# EAGLE design followLineSensor (EAGLE 7.7.0)
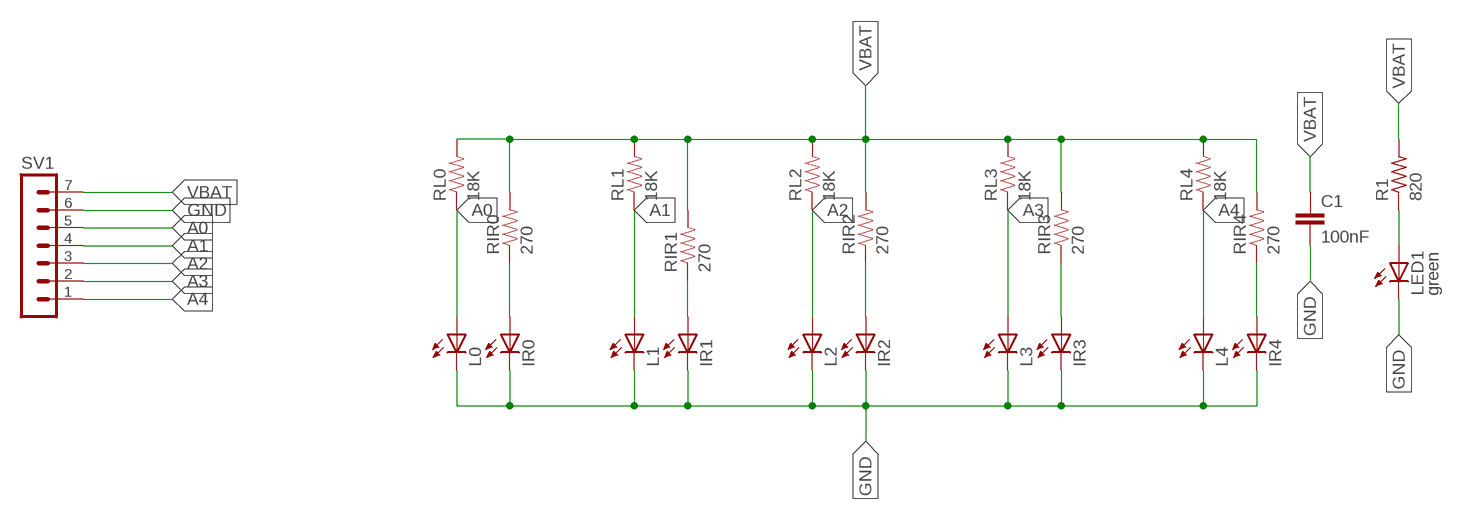
[diagram p0: schematic, sheet 1]

## Parts
C1  100nF  C-EUC0805  [C0805]
IR0  LED5MM  [LED5MM]
IR1  LED5MM  [LED5MM]
IR2  LED5MM  [LED5MM]
IR3  LED5MM  [LED5MM]
IR4  LED5MM  [LED5MM]
L0  LED5MM  [LED5MM]
L1  LED5MM  [LED5MM]
L2  LED5MM  [LED5MM]
L3  LED5MM  [LED5MM]
L4  LED5MM  [LED5MM]
LED1  green  LEDSML0805  [SML0805]
R1  820  R-US_R0805  [R0805]
RIR0  270  RESISTOR1206  [1206]
RIR1  270  RESISTOR1206  [1206]
RIR2  270  RESISTOR1206  [1206]
RIR3  270  RESISTOR1206  [1206]
RIR4  270  RESISTOR1206  [1206]
RL0  18K  RESISTOR1206  [1206]
RL1  18K  RESISTOR1206  [1206]
RL2  18K  RESISTOR1206  [1206]
RL3  18K  RESISTOR1206  [1206]
RL4  18K  RESISTOR1206  [1206]
SV1  MA07-1  [MA07-1]

## Nets
A0: L0.A RL0.1 SV1.5
A1: L1.A RL1.1 SV1.4
A2: L2.A RL2.1 SV1.3
A3: L3.A RL3.1 SV1.2
A4: L4.A RL4.1 SV1.1
GND: C1.2 IR0.K(C) IR1.K(C) IR2.K(C) IR3.K(C) IR4.K(C) L0.K(C) L1.K(C) L2.K(C) L3.K(C) L4.K(C) LED1.C SV1.6
N$2: LED1.A R1.1
N$17: IR4.A RIR4.1
N$18: IR3.A RIR3.1
N$19: IR2.A RIR2.1
N$20: IR1.A RIR1.1
N$21: IR0.A RIR0.1
VBAT: C1.1 R1.2 RIR0.2 RIR1.2 RIR2.2 RIR3.2 RIR4.2 RL0.2 RL1.2 RL2.2 RL3.2 RL4.2 SV1.7

## Library data of the parts
C1 = rcl:C-EU: CAPACITOR, European symbol
IR0 IR1-IR4 L0 L1-L4 LED1 = led:LED: LED OSRAM: - CHIPLED LG R971, LG N971, LY N971, LG Q971, LY Q971, LO R971, LY R971 LH N974, LH R974 LS Q976, LO Q976, LY Q976 LO Q996 - Hyper CHIPLED LW Q18S LB Q993, LB Q99A, LB R99A - SideLED LS A670, LO A670, LY A670, LG A670, LP A670 LB A673, LV A673, LT A673, LW A673 LH A674 LY A675 LS A676, LA A676, LO A676, LY A676, LW A676 LS A679, LY A679, LG A679 - Hyper Micro SIDELED® LS Y876, LA Y876, LO Y876, LY Y876 LT Y87S - SmartLED LW L88C, LW L88S LB L89C, LB L89S, LG L890 LS L89K, LO L89K, LY L89K LS L896, LA L896, LO L896, LY L896 - TOPLED LS T670, LO T670, LY T670, LG T670, LP T670 LSG T670, LSP T670, LSY T670, LOP T670, LYG T670 LG T671, LOG T671, LSG T671 LB T673, LV T673, LT T673, LW T673 LH T674 LS T676, LA T676, LO T676, LY T676, LB T676, LH T676, LSB T676, LW T676 LB T67C, LV T67C, LT T67C, LS T67K, LO T67K, LY T67K, LW E67C LS E67B, LA E67B, LO E67B, LY E67B, LB E67C, LV E67C, LT E67C LW T67C LS T679, LY T679, LG T679 LS T770, LO T770, LY T770, LG T770, LP T770 LB T773, LV T773, LT T773, LW T773 LH T774 LS E675, LA E675, LY E675, LS T675 LS T776, LA T776, LO T776, LY T776, LB T776 LHGB T686 LT T68C, LB T68C - Hyper Mini TOPLED® LB M676 - Mini TOPLED Santana® LG M470 LS M47K, LO M47K, LY M47K Source: http://www.osram.convergy.de LUXEON: - LUMILED® LXK2-PW12-R00, LXK2-PW12-S00, LXK2-PW14-U00, LXK2-PW14-V00 LXK2-PM12-R00, LXK2-PM12-S00, LXK2-PM14-U00 LXK2-PE12-Q00, LXK2-PE12-R00, LXK2-PE12-S00, LXK2-PE14-T00, LXK2-PE14-U00 LXK2-PB12-K00, LXK2-PB12-L00, LXK2-PB12-M00, LXK2-PB14-N00, LXK2-PB14-P00, LXK2-PB14-Q00 LXK2-PR12-L00, LXK2-PR12-M00, LXK2-PR14-Q00, LXK2-PR14-R00 LXK2-PD12-Q00, LXK2-PD12-R00, LXK2-PD12-S00 LXK2-PH12-R00, LXK2-PH12-S00 LXK2-PL12-P00, LXK2-PL12-Q00, LXK2-PL12-R00 Source: www.luxeon.com KINGBRIGHT: KA-3528ASYC Source: www.kingbright.com
R1 = rcl:R-US_: RESISTOR, American symbol
RIR0 RIR1-RIR4 RL0 RL1-RL4 = SparkFun-Passives:RESISTOR: Resistor Basic schematic elements and footprints for 0603, 1206, and PTH resistors.
SV1 = con-lstb:MA07-1: PIN HEADER; OC_FARNELL: unknown; OC_NEWARK: unknown

## Board
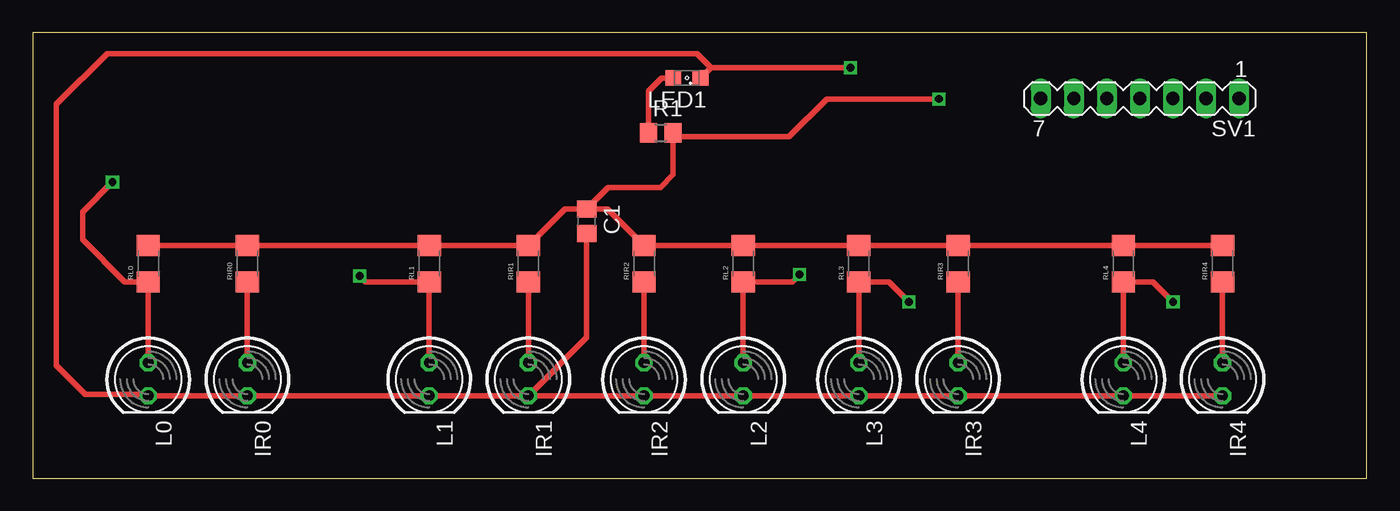
[diagram p1: board, top side]
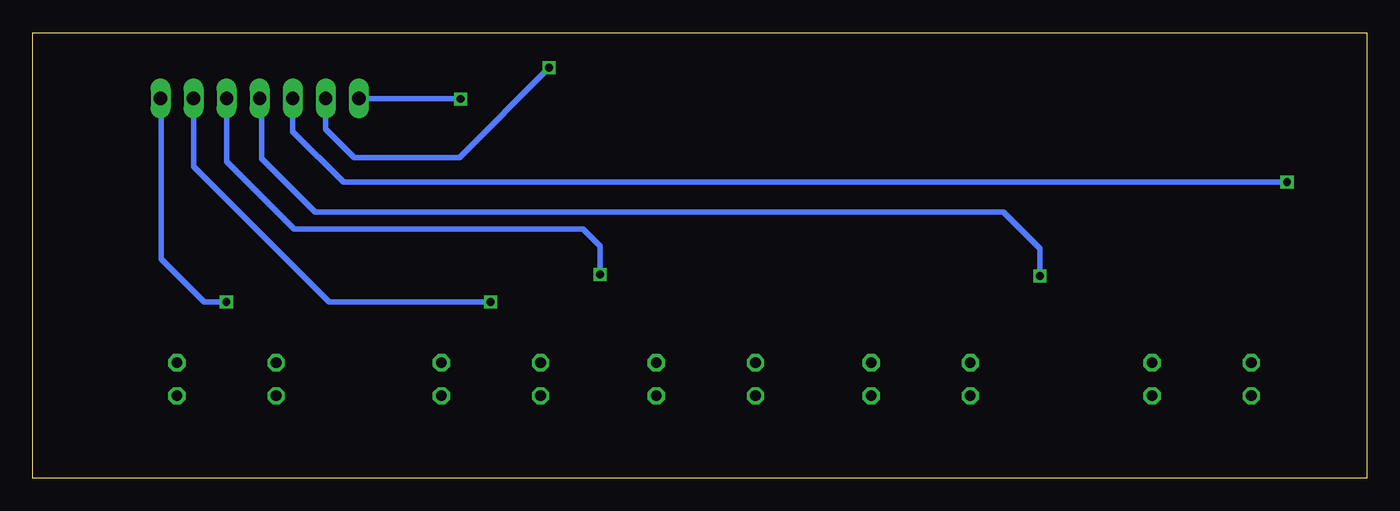
[diagram p2: board, bottom side, seen from below]

Size 102.54 x 34.28 mm. Coordinates in mm from the lower left corner, seen from the top.
Outline: 0,0 102.54,0 102.54,34.28 0,34.28 0,0
Copper layers (1*16): Top 0.035mm / dielectric 1.5mm / Bottom 0.035mm
Design rules "default *": minimum track width 0.4mm, minimum drill 24mil, track to track 8mil, track to pad 8mil, pad to pad 8mil, via to via 8mil, smd to smd 8mil, copper to edge 40mil, drill to drill 8mil, minimum pad ring 10mil, minimum via ring 8mil, stop-mask expansion 4mil, vias tented up to drill 0mil, thermal gap 10mil

### Footprints (pad centres in the part's own frame; a part is rotated, then mirrored left to right if it is on the bottom)
C0805 = smd 1.3 x 1.5: 1 -0.95,0; 2 0.95,0
LED5MM = drill 0.813 octagon: A -1.27,0; K 1.27,0
SML0805 = smd 1.2 x 1.2: A 1.05,0; C -1.05,0
R0805 = smd 1.3 x 1.5: 1 -0.95,0; 2 0.95,0
1206 = smd 1.6 x 1.8: 1 -1.4,0; 2 1.4,0
MA07-1 = drill 1.016 long: 1 -7.62,0; 2 -5.08,0; 3 -2.54,0; 4 0,0; 5 2.54,0; 6 5.08,0; 7 7.62,0

### Placement (x,y rotation side)
C1  42.58,19.77 270 top
IR0  16.51,7.62 270 top
IR1  38.1,7.62 270 top
IR2  46.99,7.62 270 top
IR3  71.12,7.62 270 top
IR4  91.44,7.62 270 top
L0  8.89,7.62 270 top
L1  30.48,7.62 270 top
L2  54.61,7.62 270 top
L3  63.5,7.62 270 top
L4  83.82,7.62 270 top
LED1  50.28,30.78 180 top
R1  48.28,26.57 0 top
RIR0  16.51,16.51 90 top
RIR1  38.1,16.51 90 top
RIR2  46.99,16.51 90 top
RIR3  71.12,16.51 90 top
RIR4  91.44,16.51 90 top
RL0  8.89,16.51 90 top
RL1  30.48,16.51 90 top
RL2  54.61,16.51 90 top
RL3  63.5,16.51 90 top
RL4  83.82,16.51 90 top
SV1  85.09,29.21 180 top

### Tracks (layer width: path | path; a pad name or v marks a point on that pad's centre or on a via)
A0  (via drill 0.6)
  Top 0.406: L0.A RL0.1 7.1,15.11 3.84,18.37 3.84,20.47 v6.14,22.77
  Bottom 0.406: v6.14,22.77 78.64,22.77 82.54,26.67 SV1.5
A1  (via drill 0.6)
  Top 0.406: L1.A RL1.1 25.6,15.11 v25.14,15.57
  Bottom 0.406: v25.14,15.57 25.14,17.67 27.94,20.47 80.84,20.47 84.94,24.57 84.94,29.06 SV1.4
A2  (via drill 0.6)
  Top 0.406: L2.A RL2.1 58.38,15.11 v58.94,15.67
  Bottom 0.406: v58.94,15.67 58.94,17.87 60.24,19.17 82.44,19.17 87.64,24.37 SV1.3
A3  (via drill 0.6)
  Top 0.406: L3.A RL3.1 65.8,15.11 v67.34,13.57
  Bottom 0.406: v67.34,13.57 79.74,13.57 90.14,23.97 90.14,29.18 SV1.2
A4  (via drill 0.6)
  Top 0.406: L4.A RL4.1 86.1,15.11 v87.64,13.57
  Bottom 0.406: v87.64,13.57 89.34,13.57 92.64,16.87 92.64,29.14 SV1.1
GND  (via drill 0.6)
  Top 0.406: IR1.K L1.K IR0.K L0.K 8.77,6.47 4.04,6.47 1.84,8.67 1.84,28.77 5.74,32.67 51.04,32.67 52.14,31.57 | IR1.K IR2.K L2.K L3.K IR3.K L4.K IR4.K | C1.2 42.58,10.83 IR1.K | v62.84,31.57 52.14,31.57 | 52.14,31.57 52.12,31.57 LED1.C 51.35,30.78 52.14,31.57
  Bottom 0.406: SV1.6 80.01,26.84 77.84,24.67 69.74,24.67 v62.84,31.57
N$2
  Top 0.406: LED1.A 48.35,30.78 47.34,29.77 R1.1
N$17
  Top 0.406: RIR4.1 IR4.A
N$18
  Top 0.406: RIR3.1 IR3.A
N$19
  Top 0.406: RIR2.1 IR2.A
N$20
  Top 0.406: RIR1.1 IR1.A
N$21
  Top 0.406: RIR0.1 IR0.A
VBAT  (via drill 0.6)
  Top 0.406: RL0.2 RIR0.2 RL1.2 RIR1.2 40.91,20.72 C1.1 | RIR4.2 RL4.2 RIR3.2 RL3.2 RL2.2 RIR2.2 44.18,20.72 C1.1 | v69.64,29.17 61.04,29.17 58.14,26.27 49.53,26.27 R1.2 49.23,23.36 48.24,22.37 44.23,22.37 C1.1
  Bottom 0.406: SV1.7 69.68,29.21 v69.64,29.17